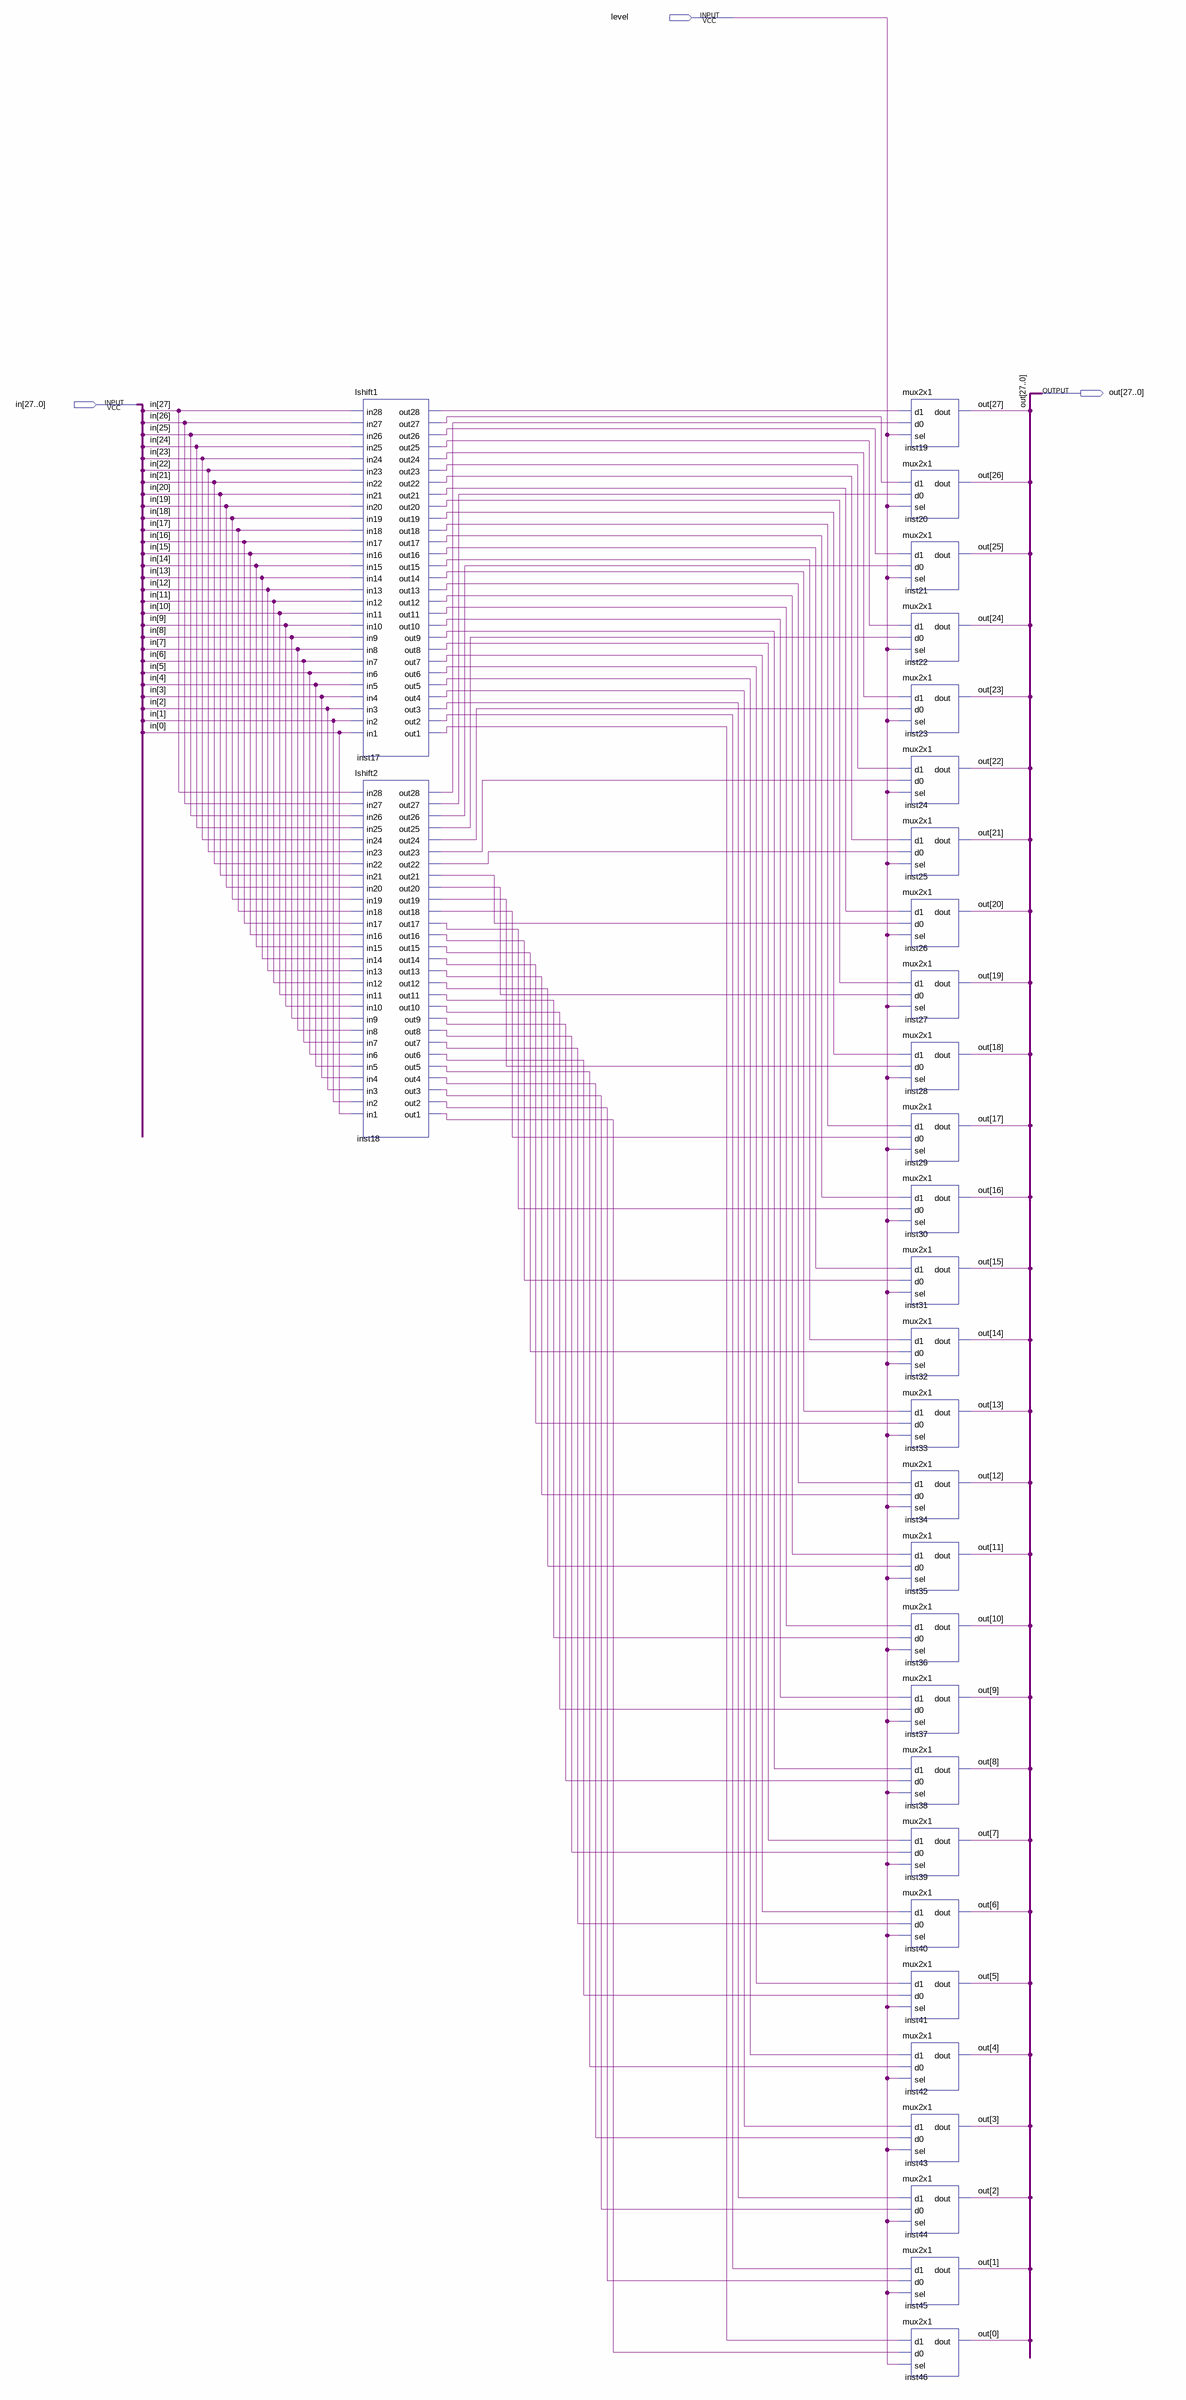
[diagram p0: schematic sheet]
// Quartus schematic ks_lelft_shift.bdf as structural Verilog: 30 symbols, 3 pins
module ks_lelft_shift (
  input  level,
  input  [27:0] in,
  output [27:0] out
);

  wire inst17_out1, inst17_out2, inst17_out3, inst17_out4, inst17_out5, inst17_out6, inst17_out7,
       inst17_out8, inst17_out9, inst17_out10, inst17_out11, inst17_out12, inst17_out13, inst17_out14,
       inst17_out15, inst17_out16, inst17_out17, inst17_out18, inst17_out19, inst17_out20, inst17_out21,
       inst17_out22, inst17_out23, inst17_out24, inst17_out25, inst17_out26, inst17_out27, inst17_out28,
       inst18_out1, inst18_out2, inst18_out3, inst18_out4, inst18_out5, inst18_out6, inst18_out7,
       inst18_out8, inst18_out9, inst18_out10, inst18_out11, inst18_out12, inst18_out13, inst18_out14,
       inst18_out15, inst18_out16, inst18_out17, inst18_out18, inst18_out19, inst18_out20, inst18_out21,
       inst18_out22, inst18_out23, inst18_out24, inst18_out25, inst18_out26, inst18_out27, inst18_out28;

  lshift1 inst17 (
    .in28(in[27]), .in27(in[26]), .in26(in[25]), .in25(in[24]), .in24(in[23]), .in23(in[22]), .in22(in[21]),
    .in21(in[20]), .in20(in[19]), .in19(in[18]), .in18(in[17]), .in17(in[16]), .in16(in[15]), .in15(in[14]),
    .in14(in[13]), .in13(in[12]), .in12(in[11]), .in11(in[10]), .in10(in[9]), .in9(in[8]), .in8(in[7]),
    .in7(in[6]), .in6(in[5]), .in5(in[4]), .in4(in[3]), .in3(in[2]), .in2(in[1]), .in1(in[0]),
    .out28(inst17_out28), .out27(inst17_out27), .out26(inst17_out26), .out25(inst17_out25),
    .out24(inst17_out24), .out23(inst17_out23), .out22(inst17_out22), .out21(inst17_out21),
    .out20(inst17_out20), .out19(inst17_out19), .out18(inst17_out18), .out17(inst17_out17),
    .out16(inst17_out16), .out15(inst17_out15), .out14(inst17_out14), .out13(inst17_out13),
    .out12(inst17_out12), .out11(inst17_out11), .out10(inst17_out10), .out9(inst17_out9), .out8(inst17_out8),
    .out7(inst17_out7), .out6(inst17_out6), .out5(inst17_out5), .out4(inst17_out4), .out3(inst17_out3),
    .out2(inst17_out2), .out1(inst17_out1));
  lshift2 inst18 (
    .in28(in[27]), .in27(in[26]), .in26(in[25]), .in25(in[24]), .in24(in[23]), .in23(in[22]), .in22(in[21]),
    .in21(in[20]), .in20(in[19]), .in19(in[18]), .in18(in[17]), .in17(in[16]), .in16(in[15]), .in15(in[14]),
    .in14(in[13]), .in13(in[12]), .in12(in[11]), .in11(in[10]), .in10(in[9]), .in9(in[8]), .in8(in[7]),
    .in7(in[6]), .in6(in[5]), .in5(in[4]), .in4(in[3]), .in3(in[2]), .in2(in[1]), .in1(in[0]),
    .out28(inst18_out28), .out27(inst18_out27), .out26(inst18_out26), .out25(inst18_out25),
    .out24(inst18_out24), .out23(inst18_out23), .out22(inst18_out22), .out21(inst18_out21),
    .out20(inst18_out20), .out19(inst18_out19), .out18(inst18_out18), .out17(inst18_out17),
    .out16(inst18_out16), .out15(inst18_out15), .out14(inst18_out14), .out13(inst18_out13),
    .out12(inst18_out12), .out11(inst18_out11), .out10(inst18_out10), .out9(inst18_out9), .out8(inst18_out8),
    .out7(inst18_out7), .out6(inst18_out6), .out5(inst18_out5), .out4(inst18_out4), .out3(inst18_out3),
    .out2(inst18_out2), .out1(inst18_out1));
  mux2x1 inst19 (.d1(inst17_out28), .d0(inst18_out28), .sel(level), .dout(out[27]));
  mux2x1 inst20 (.d1(inst17_out27), .d0(inst18_out27), .sel(level), .dout(out[26]));
  mux2x1 inst21 (.d1(inst17_out26), .d0(inst18_out26), .sel(level), .dout(out[25]));
  mux2x1 inst22 (.d1(inst17_out25), .d0(inst18_out25), .sel(level), .dout(out[24]));
  mux2x1 inst23 (.d1(inst17_out24), .d0(inst18_out24), .sel(level), .dout(out[23]));
  mux2x1 inst24 (.d1(inst17_out23), .d0(inst18_out23), .sel(level), .dout(out[22]));
  mux2x1 inst25 (.d1(inst17_out22), .d0(inst18_out22), .sel(level), .dout(out[21]));
  mux2x1 inst26 (.d1(inst17_out21), .d0(inst18_out21), .sel(level), .dout(out[20]));
  mux2x1 inst27 (.d1(inst17_out20), .d0(inst18_out20), .sel(level), .dout(out[19]));
  mux2x1 inst28 (.d1(inst17_out19), .d0(inst18_out19), .sel(level), .dout(out[18]));
  mux2x1 inst29 (.d1(inst17_out18), .d0(inst18_out18), .sel(level), .dout(out[17]));
  mux2x1 inst30 (.d1(inst17_out17), .d0(inst18_out17), .sel(level), .dout(out[16]));
  mux2x1 inst31 (.d1(inst17_out16), .d0(inst18_out16), .sel(level), .dout(out[15]));
  mux2x1 inst32 (.d1(inst17_out15), .d0(inst18_out15), .sel(level), .dout(out[14]));
  mux2x1 inst33 (.d1(inst17_out14), .d0(inst18_out14), .sel(level), .dout(out[13]));
  mux2x1 inst34 (.d1(inst17_out13), .d0(inst18_out13), .sel(level), .dout(out[12]));
  mux2x1 inst35 (.d1(inst17_out12), .d0(inst18_out12), .sel(level), .dout(out[11]));
  mux2x1 inst36 (.d1(inst17_out11), .d0(inst18_out11), .sel(level), .dout(out[10]));
  mux2x1 inst37 (.d1(inst17_out10), .d0(inst18_out10), .sel(level), .dout(out[9]));
  mux2x1 inst38 (.d1(inst17_out9), .d0(inst18_out9), .sel(level), .dout(out[8]));
  mux2x1 inst39 (.d1(inst17_out8), .d0(inst18_out8), .sel(level), .dout(out[7]));
  mux2x1 inst40 (.d1(inst17_out7), .d0(inst18_out7), .sel(level), .dout(out[6]));
  mux2x1 inst41 (.d1(inst17_out6), .d0(inst18_out6), .sel(level), .dout(out[5]));
  mux2x1 inst42 (.d1(inst17_out5), .d0(inst18_out5), .sel(level), .dout(out[4]));
  mux2x1 inst43 (.d1(inst17_out4), .d0(inst18_out4), .sel(level), .dout(out[3]));
  mux2x1 inst44 (.d1(inst17_out3), .d0(inst18_out3), .sel(level), .dout(out[2]));
  mux2x1 inst45 (.d1(inst17_out2), .d0(inst18_out2), .sel(level), .dout(out[1]));
  mux2x1 inst46 (.d1(inst17_out1), .d0(inst18_out1), .sel(level), .dout(out[0]));
endmodule
